# EAGLE schematic LT3579_SEPIC_Test_Bench (EAGLE 9.6.2)

## Sheet 1 of 4
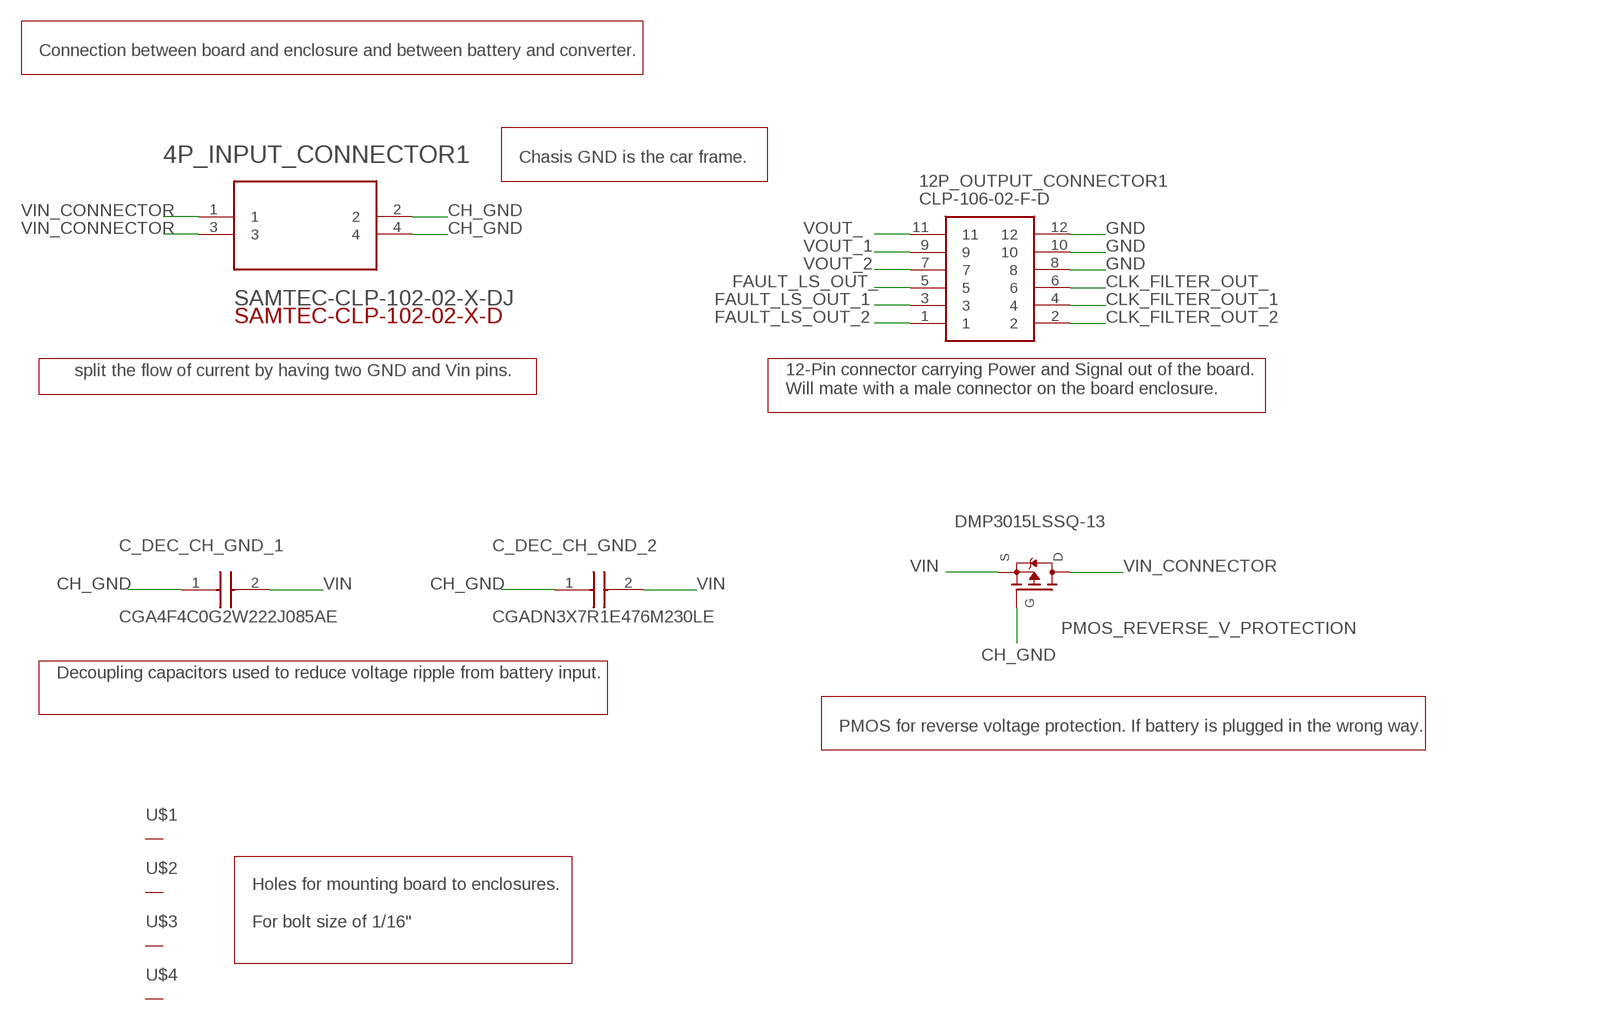
[diagram p0: schematic, sheet 1]

### Parts
4P_INPUT_CONNECTOR1  SAMTEC-CLP-102-02-X-DJ  [SAMTEC-CLP-102-02-X-D]
12P_OUTPUT_CONNECTOR1  CLP-106-02-F-D  [CLP-106-02-XXX]
C_DEC_CH_GND_1  CGA4F4C0G2W222J085AE  [CAPC2012X100N]
C_DEC_CH_GND_2  CGADN3X7R1E476M230LE  [CAPC7563X250N]
PMOS_REVERSE_V_PROTECTION  DMP3015LSSQ-13  [SOIC127P600X170-8N]
U$1  THROUGH_HOLE_  [THROUGH_HOLE]
U$2  THROUGH_HOLE_  [THROUGH_HOLE]
U$3  THROUGH_HOLE_  [THROUGH_HOLE]
U$4  THROUGH_HOLE_  [THROUGH_HOLE]

### Nets
CH_GND [PWR_Vin_Vout]: 4P_INPUT_CONNECTOR1.2 4P_INPUT_CONNECTOR1.4 C_DEC_CH_GND_1.1 C_DEC_CH_GND_2.1 PMOS_REVERSE_V_PROTECTION.4(G1) ; also sheet 2,3,4
CLK_FILTER_OUT_ [Signal]: 12P_OUTPUT_CONNECTOR1.6 ; also sheet 2
CLK_FILTER_OUT_1 [Signal]: 12P_OUTPUT_CONNECTOR1.4 ; also sheet 3
CLK_FILTER_OUT_2 [Signal]: 12P_OUTPUT_CONNECTOR1.2 ; also sheet 4
FAULT_LS_OUT_ [Signal]: 12P_OUTPUT_CONNECTOR1.5 ; also sheet 2
FAULT_LS_OUT_1 [Signal]: 12P_OUTPUT_CONNECTOR1.3 ; also sheet 3
FAULT_LS_OUT_2 [Signal]: 12P_OUTPUT_CONNECTOR1.1 ; also sheet 4
GND: 12P_OUTPUT_CONNECTOR1.8 12P_OUTPUT_CONNECTOR1.10 12P_OUTPUT_CONNECTOR1.12 ; also sheet 2,3,4
VIN [PWR_Vin]: C_DEC_CH_GND_1.2 C_DEC_CH_GND_2.2 PMOS_REVERSE_V_PROTECTION.1(S1) PMOS_REVERSE_V_PROTECTION.2(S1) PMOS_REVERSE_V_PROTECTION.3(S1) ; also sheet 2,3,4
VIN_CONNECTOR [PWR_Connector]: 4P_INPUT_CONNECTOR1.1 4P_INPUT_CONNECTOR1.3 PMOS_REVERSE_V_PROTECTION.5(D1) PMOS_REVERSE_V_PROTECTION.6(D1) PMOS_REVERSE_V_PROTECTION.7(D1) PMOS_REVERSE_V_PROTECTION.8(D1)
VOUT_ [PWR_Vin_Vout]: 12P_OUTPUT_CONNECTOR1.11 ; also sheet 2
VOUT_1 [PWR_Vin_Vout]: 12P_OUTPUT_CONNECTOR1.9 ; also sheet 3
VOUT_2 [PWR_Vin_Vout]: 12P_OUTPUT_CONNECTOR1.7 ; also sheet 4
Unconnected: U$1.THROUGH_HOLE U$2.THROUGH_HOLE U$3.THROUGH_HOLE U$4.THROUGH_HOLE

### Notes on the sheet
- Connection between board and enclosure and between battery and converter.
- Chasis GND is the car frame.
- split the flow of current by having two GND and Vin pins.
- 12-Pin connector carrying Power and Signal out of the board. 
  Will mate with a male connector on the board enclosure.
- Decoupling capacitors used to reduce voltage ripple from battery input.
- PMOS for reverse voltage protection. If battery is plugged in the wrong way.
- Holes for mounting board to enclosures.
  
  For bolt size of 1/16"

## Sheet 2 of 4
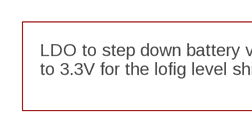
[diagram p1: schematic, sheet 2, part 1 of 2]
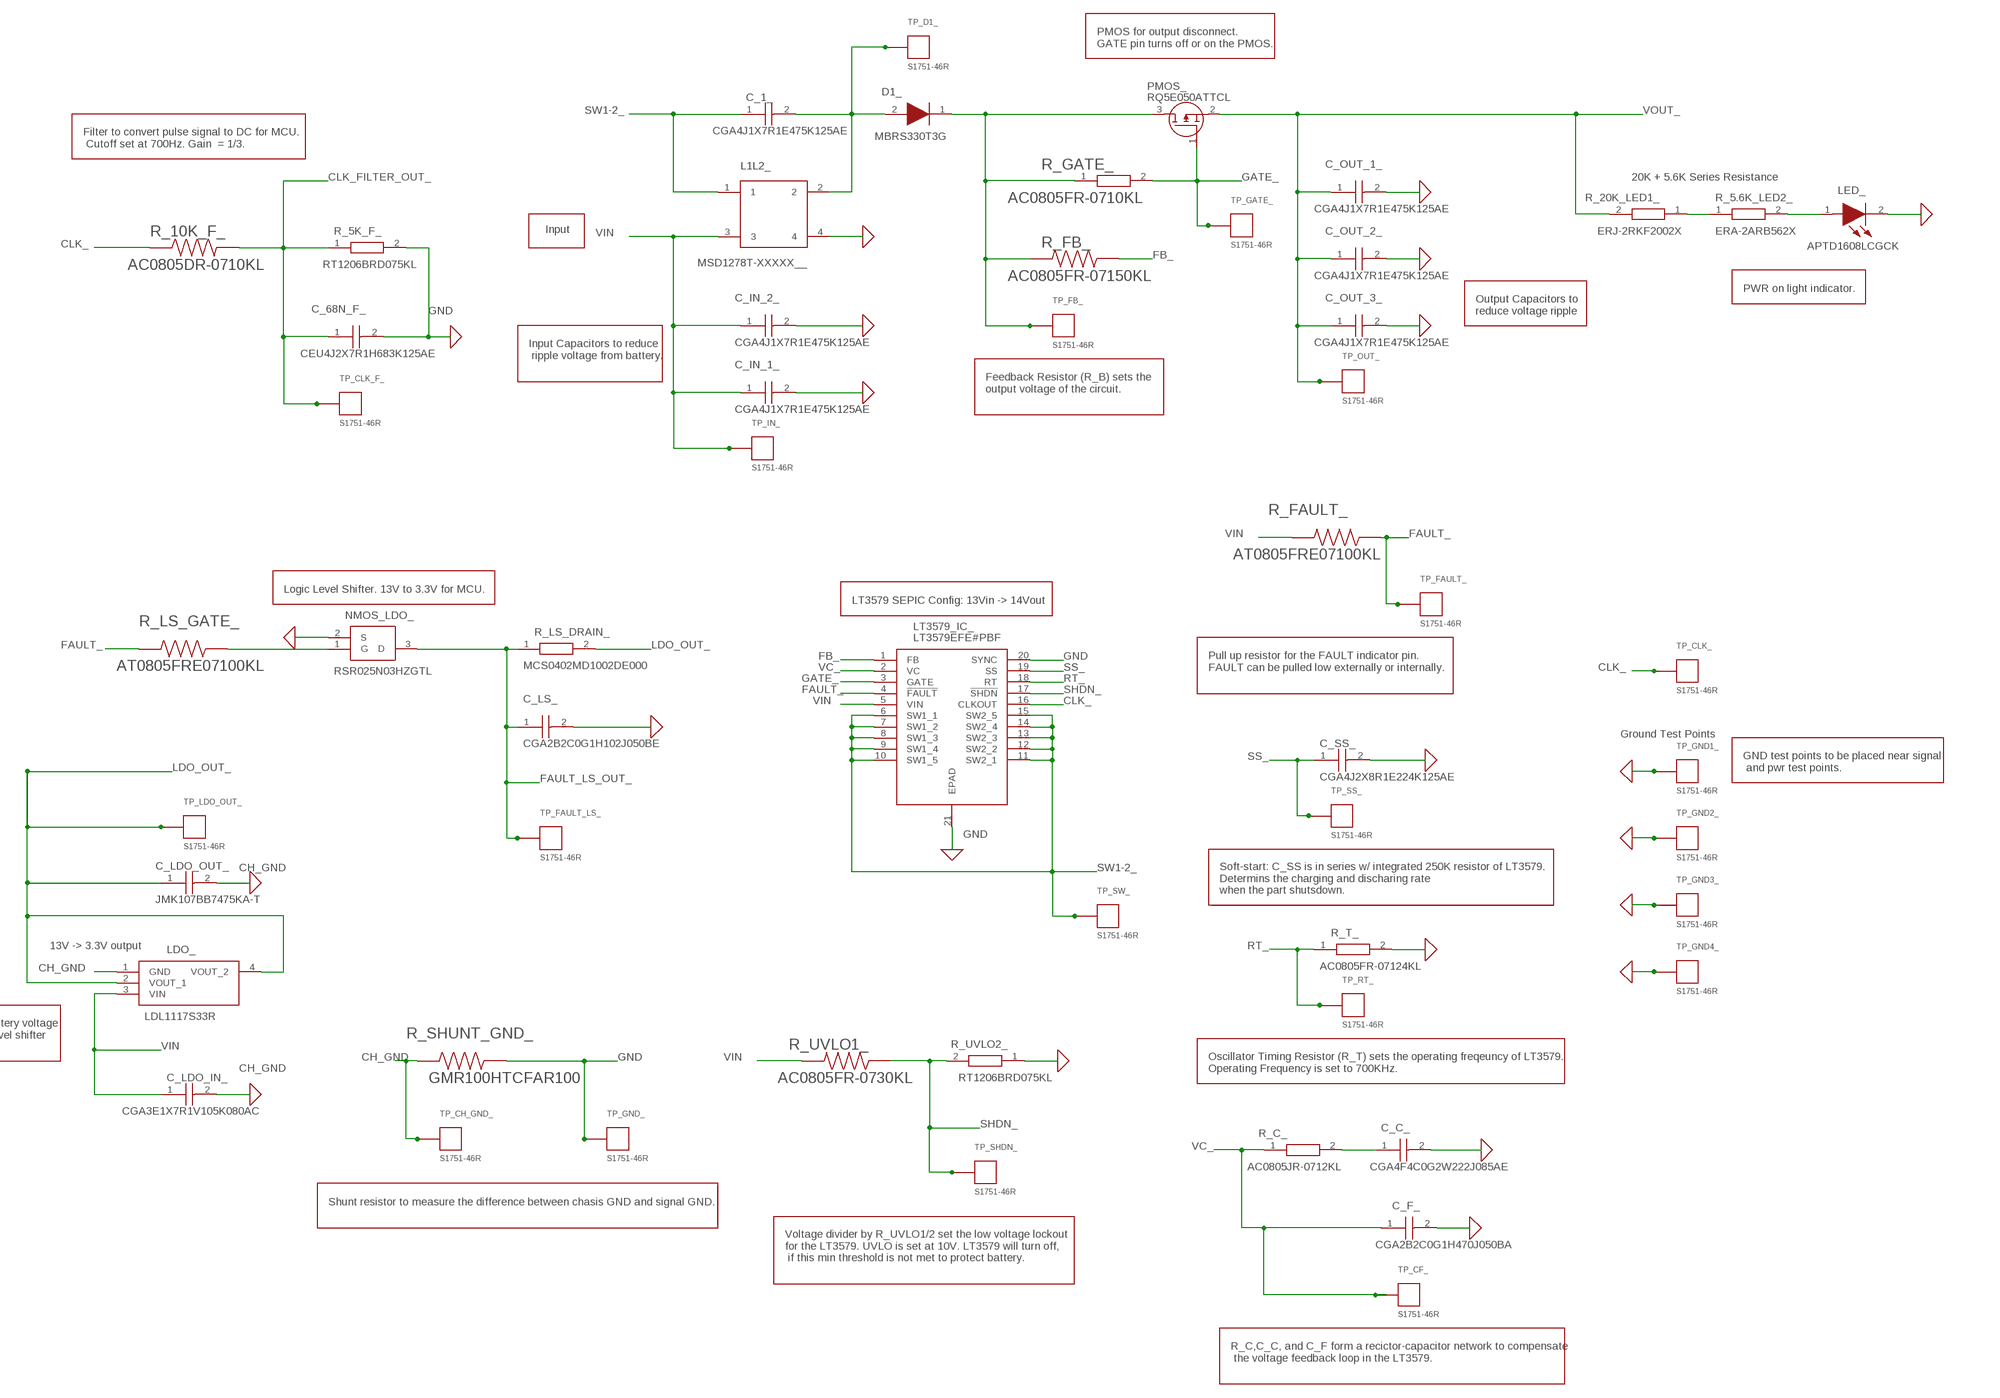
[diagram p2: schematic, sheet 2, part 2 of 2]

### Parts
C_1_  CGA4J1X7R1E475K125AE  [CAPC2012X145N]
C_68N_F_  CEU4J2X7R1H683K125AE  [CAPC2013X150N]
C_C_  CGA4F4C0G2W222J085AE  [CAPC2012X100N]
C_F_  CGA2B2C0G1H470J050BA  [CAPC1005X55N]
C_IN_1_  CGA4J1X7R1E475K125AE  [CAPC2012X145N]
C_IN_2_  CGA4J1X7R1E475K125AE  [CAPC2012X145N]
C_LDO_IN_  CGA3E1X7R1V105K080AC  [CAPC1608X90N]
C_LDO_OUT_  JMK107BB7475KA-T  [CAPC1608X90N]
C_LS_  CGA2B2C0G1H102J050BE  [CAPC1005X55N]
C_OUT_1_  CGA4J1X7R1E475K125AE  [CAPC2012X145N]
C_OUT_2_  CGA4J1X7R1E475K125AE  [CAPC2012X145N]
C_OUT_3_  CGA4J1X7R1E475K125AE  [CAPC2012X145N]
C_SS_  CGA4J2X8R1E224K125AE  [CAPC2012X145N]
D1_  MBRS330T3G  [DIOM7958X256N]
L1L2_  MSD1278T-XXXXX__  [MSD1278T-822MLXX]
LDO_  LDL1117S33R  [SOT230P700X180-4N]
LED_  APTD1608LCGCK  [APT1608CGCK]
LT3579_IC_  LT3579EFE#PBF  [SOP65P640X120-21N]
NMOS_LDO_  RSR025N03HZGTL  [SOT95P280X100-3N]
PMOS_  RQ5E050ATTCL  [SOT95P280X100-3N]
R_5.6K_LED2_  ERA-2ARB562X  [ERA2AED122X]
R_5K_F_  RT1206BRD075KL  [RESC3116X65N]
R_10K_F_  AC0805DR-0710KL  [RESC2012X60N]
R_20K_LED1_  ERJ-2RKF2002X  [ERJ2R_(0402)]
R_C_  AC0805JR-0712KL  [RESC2012X60N]
R_FAULT_  AT0805FRE07100KL  [RESC2012X60N]
R_FB_  AC0805FR-07150KL  [RESC2012X60N]
R_GATE_  AC0805FR-0710KL  [RESC2012X60N]
R_LS_DRAIN_  MCS0402MD1002DE000  [RESC1005X37N]
R_LS_GATE_  AT0805FRE07100KL  [RESC2012X60N]
R_SHUNT_GND_  GMR100HTCFAR100  [RESC6432X55N]
R_T_  AC0805FR-07124KL  [RESC2012X60N]
R_UVLO1_  AC0805FR-0730KL  [RESC2012X60N]
R_UVLO2_  RT1206BRD075KL  [RESC3116X65N]
TP_CF_  S1751-46R  [S1751-46R_]
TP_CH_GND_  S1751-46R  [S1751-46R_]
TP_CLK_  S1751-46R  [S1751-46R_]
TP_CLK_F_  S1751-46R  [S1751-46R_]
TP_D1_  S1751-46R  [S1751-46R_]
TP_FAULT_  S1751-46R  [S1751-46R_]
TP_FAULT_LS_  S1751-46R  [S1751-46R_]
TP_FB_  S1751-46R  [S1751-46R_]
TP_GATE_  S1751-46R  [S1751-46R_]
TP_GND1_  S1751-46R  [S1751-46R_]
TP_GND2_  S1751-46R  [S1751-46R_]
TP_GND3_  S1751-46R  [S1751-46R_]
TP_GND4_  S1751-46R  [S1751-46R_]
TP_GND_  S1751-46R  [S1751-46R_]
TP_IN_  S1751-46R  [S1751-46R_]
TP_LDO_OUT_  S1751-46R  [S1751-46R_]
TP_OUT_  S1751-46R  [S1751-46R_]
TP_RT_  S1751-46R  [S1751-46R_]
TP_SHDN_  S1751-46R  [S1751-46R_]
TP_SS_  S1751-46R  [S1751-46R_]
TP_SW_  S1751-46R  [S1751-46R_]

### Nets
CH_GND [PWR_Vin_Vout]: C_LDO_IN_.2 C_LDO_OUT_.2 LDO_.1(GND) R_SHUNT_GND_.1 TP_CH_GND_.1 ; supply symbol labelled GND ; also sheet 1,3,4
CLK_ [Signal]: LT3579_IC_.16(CLKOUT) R_10K_F_.1 TP_CLK_.1
CLK_FILTER_OUT_ [Signal]: C_68N_F_.1 R_5K_F_.1 R_10K_F_.2 TP_CLK_F_.1 ; also sheet 1
FAULT_ [Signal]: LT3579_IC_.4(!FAULT) R_FAULT_.1 R_LS_GATE_.1 TP_FAULT_.1
FAULT_LS_OUT_ [Signal]: C_LS_.1 NMOS_LDO_.3(D) R_LS_DRAIN_.1 TP_FAULT_LS_.1 ; also sheet 1
FB_ [Signal]: LT3579_IC_.1(FB) R_FB_.2
GATE_ [Signal]: LT3579_IC_.3(GATE) PMOS_.1(G) R_GATE_.2 TP_GATE_.1
GND: C_68N_F_.2 C_C_.2 C_F_.2 C_IN_1_.2 C_IN_2_.2 C_LS_.2 C_OUT_1_.2 C_OUT_2_.2 C_OUT_3_.2 C_SS_.2 L1L2_.4 LED_.2(K) LT3579_IC_.20(SYNC) LT3579_IC_.21(EPAD) NMOS_LDO_.2(S) R_5K_F_.2 R_SHUNT_GND_.2 R_T_.2 R_UVLO2_.1 TP_GND1_.1 TP_GND2_.1 TP_GND3_.1 TP_GND4_.1 TP_GND_.1 ; also sheet 1,3,4
LDO_OUT_ [PWR_Vin_Vout]: C_LDO_OUT_.1 LDO_.2(VOUT_1) LDO_.4(VOUT_2) R_LS_DRAIN_.2 TP_LDO_OUT_.1 ; also sheet 3,4
N$4 [Signal]: C_C_.1 R_C_.2
N$8 [Signal]: NMOS_LDO_.1(G) R_LS_GATE_.2
N$9 [PWR_Vin_Vout]: C_1_.2 D1_.2(A) L1L2_.2 TP_D1_.1
N$12 [Signal]: R_5.6K_LED2_.1 R_20K_LED1_.1
N$13 [PWR_Vin_Vout]: D1_.1(K) PMOS_.3(D) R_FB_.1 R_GATE_.1 TP_FB_.1
N$15 [Signal]: LED_.1(A) R_5.6K_LED2_.2
RT_ [Signal]: LT3579_IC_.18(RT) R_T_.1 TP_RT_.1
SHDN_ [Signal]: LT3579_IC_.17(!SHDN) R_UVLO1_.1 R_UVLO2_.2 TP_SHDN_.1
SS_ [Signal]: C_SS_.1 LT3579_IC_.19(SS) TP_SS_.1
SW1-2_ [PWR_Vin_Vout]: C_1_.1 L1L2_.1 LT3579_IC_.6(SW1_1) LT3579_IC_.7(SW1_2) LT3579_IC_.8(SW1_3) LT3579_IC_.9(SW1_4) LT3579_IC_.10(SW1_5) LT3579_IC_.11(SW2_1) LT3579_IC_.12(SW2_2) LT3579_IC_.13(SW2_3) LT3579_IC_.14(SW2_4) LT3579_IC_.15(SW2_5) TP_SW_.1
VC_ [Signal]: C_F_.1 LT3579_IC_.2(VC) R_C_.1 TP_CF_.1
VIN [PWR_Vin]: C_IN_1_.1 C_IN_2_.1 C_LDO_IN_.1 L1L2_.3 LDO_.3(VIN) LT3579_IC_.5(VIN) R_FAULT_.2 R_UVLO1_.2 TP_IN_.1 ; also sheet 1,3,4
VOUT_ [PWR_Vin_Vout]: C_OUT_1_.1 C_OUT_2_.1 C_OUT_3_.1 PMOS_.2(S) R_20K_LED1_.2 TP_OUT_.1 ; also sheet 1

### Notes on the sheet
- PMOS for output disconnect. 
  GATE pin turns off or on the PMOS.
- Filter to convert pulse signal to DC for MCU.
   Cutoff set at 700Hz. Gain  = 1/3.
- 20K + 5.6K Series Resistance
- Input
- PWR on light indicator.
- Output Capacitors to 
  reduce voltage ripple
- Input Capacitors to reduce
   ripple voltage from battery.
- Feedback Resistor (R_B) sets the
  output voltage of the circuit.
- Logic Level Shifter. 13V to 3.3V for MCU.
- LT3579 SEPIC Config: 13Vin -> 14Vout
- Pull up resistor for the FAULT indicator pin. 
  FAULT can be pulled low externally or internally.
- Ground Test Points
- GND test points to be placed near signal
   and pwr test points.
- Soft-start: C_SS is in series w/ integrated 250K resistor of LT3579. 
  Determins the charging and discharing rate 
  when the part shutsdown.
- 13V -> 3.3V output
- LDO to step down battery voltage
  to 3.3V for the lofig level shifter
- Oscillator Timing Resistor (R_T) sets the operating freqeuncy of LT3579. 
  Operating Frequency is set to 700KHz.
- Shunt resistor to measure the difference between chasis GND and signal GND.
- Voltage divider by R_UVLO1/2 set the low voltage lockout 
  for the LT3579. UVLO is set at 10V. LT3579 will turn off,
   if this min threshold is not met to protect battery.
- R_C,C_C, and C_F form a recictor-capacitor network to compensate
   the voltage feedback loop in the LT3579.

## Sheet 3 of 4
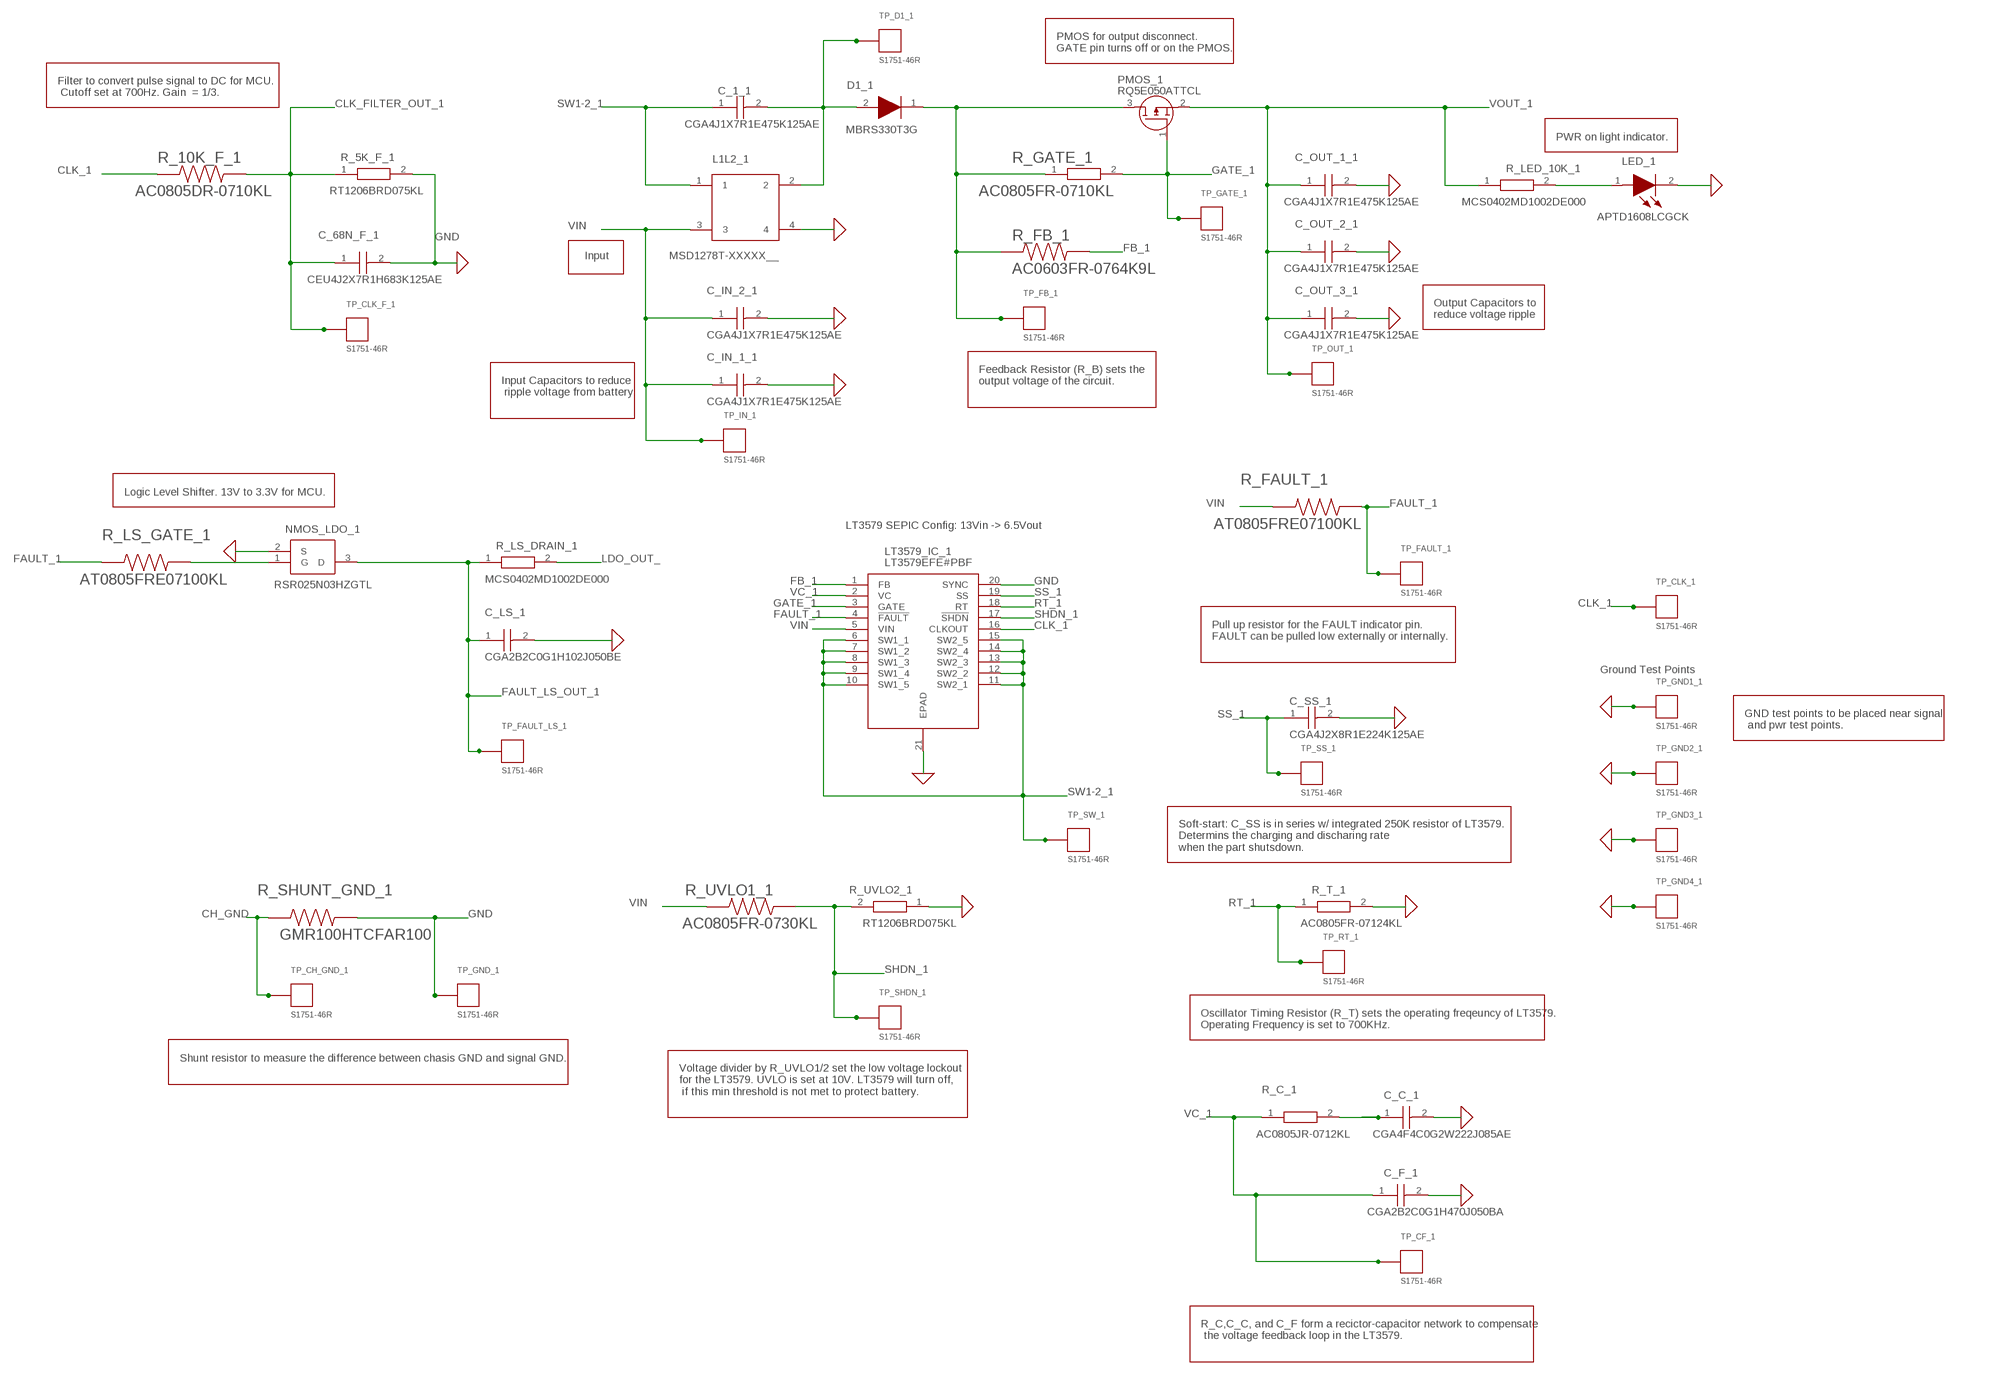
[diagram p3: schematic, sheet 3]

### Parts
C_1_1  CGA4J1X7R1E475K125AE  [CAPC2012X145N]
C_68N_F_1  CEU4J2X7R1H683K125AE  [CAPC2013X150N]
C_C_1  CGA4F4C0G2W222J085AE  [CAPC2012X100N]
C_F_1  CGA2B2C0G1H470J050BA  [CAPC1005X55N]
C_IN_1_1  CGA4J1X7R1E475K125AE  [CAPC2012X145N]
C_IN_2_1  CGA4J1X7R1E475K125AE  [CAPC2012X145N]
C_LS_1  CGA2B2C0G1H102J050BE  [CAPC1005X55N]
C_OUT_1_1  CGA4J1X7R1E475K125AE  [CAPC2012X145N]
C_OUT_2_1  CGA4J1X7R1E475K125AE  [CAPC2012X145N]
C_OUT_3_1  CGA4J1X7R1E475K125AE  [CAPC2012X145N]
C_SS_1  CGA4J2X8R1E224K125AE  [CAPC2012X145N]
D1_1  MBRS330T3G  [DIOM7958X256N]
L1L2_1  MSD1278T-XXXXX__  [MSD1278T-822MLXX]
LED_1  APTD1608LCGCK  [APT1608CGCK]
LT3579_IC_1  LT3579EFE#PBF  [SOP65P640X120-21N]
NMOS_LDO_1  RSR025N03HZGTL  [SOT95P280X100-3N]
PMOS_1  RQ5E050ATTCL  [SOT95P280X100-3N]
R_5K_F_1  RT1206BRD075KL  [RESC3116X65N]
R_10K_F_1  AC0805DR-0710KL  [RESC2012X60N]
R_C_1  AC0805JR-0712KL  [RESC2012X60N]
R_FAULT_1  AT0805FRE07100KL  [RESC2012X60N]
R_FB_1  AC0603FR-0764K9L  [RESC1608X55N]
R_GATE_1  AC0805FR-0710KL  [RESC2012X60N]
R_LED_10K_1  MCS0402MD1002DE000  [RESC1005X37N]
R_LS_DRAIN_1  MCS0402MD1002DE000  [RESC1005X37N]
R_LS_GATE_1  AT0805FRE07100KL  [RESC2012X60N]
R_SHUNT_GND_1  GMR100HTCFAR100  [RESC6432X55N]
R_T_1  AC0805FR-07124KL  [RESC2012X60N]
R_UVLO1_1  AC0805FR-0730KL  [RESC2012X60N]
R_UVLO2_1  RT1206BRD075KL  [RESC3116X65N]
TP_CF_1  S1751-46R  [S1751-46R_]
TP_CH_GND_1  S1751-46R  [S1751-46R_]
TP_CLK_1  S1751-46R  [S1751-46R_]
TP_CLK_F_1  S1751-46R  [S1751-46R_]
TP_D1_1  S1751-46R  [S1751-46R_]
TP_FAULT_1  S1751-46R  [S1751-46R_]
TP_FAULT_LS_1  S1751-46R  [S1751-46R_]
TP_FB_1  S1751-46R  [S1751-46R_]
TP_GATE_1  S1751-46R  [S1751-46R_]
TP_GND1_1  S1751-46R  [S1751-46R_]
TP_GND2_1  S1751-46R  [S1751-46R_]
TP_GND3_1  S1751-46R  [S1751-46R_]
TP_GND4_1  S1751-46R  [S1751-46R_]
TP_GND_1  S1751-46R  [S1751-46R_]
TP_IN_1  S1751-46R  [S1751-46R_]
TP_OUT_1  S1751-46R  [S1751-46R_]
TP_RT_1  S1751-46R  [S1751-46R_]
TP_SHDN_1  S1751-46R  [S1751-46R_]
TP_SS_1  S1751-46R  [S1751-46R_]
TP_SW_1  S1751-46R  [S1751-46R_]

### Nets
CH_GND [PWR_Vin_Vout]: R_SHUNT_GND_1.1 TP_CH_GND_1.1 ; also sheet 1,2,4
CLK_1 [Signal]: LT3579_IC_1.16(CLKOUT) R_10K_F_1.1 TP_CLK_1.1
CLK_FILTER_OUT_1 [Signal]: C_68N_F_1.1 R_5K_F_1.1 R_10K_F_1.2 TP_CLK_F_1.1 ; also sheet 1
FAULT_1 [Signal]: LT3579_IC_1.4(!FAULT) R_FAULT_1.1 R_LS_GATE_1.1 TP_FAULT_1.1
FAULT_LS_OUT_1 [Signal]: C_LS_1.1 NMOS_LDO_1.3(D) R_LS_DRAIN_1.1 TP_FAULT_LS_1.1 ; also sheet 1
FB_1 [Signal]: LT3579_IC_1.1(FB) R_FB_1.2
GATE_1 [Signal]: LT3579_IC_1.3(GATE) PMOS_1.1(G) R_GATE_1.2 TP_GATE_1.1
GND: C_68N_F_1.2 C_C_1.2 C_F_1.2 C_IN_1_1.2 C_IN_2_1.2 C_LS_1.2 C_OUT_1_1.2 C_OUT_2_1.2 C_OUT_3_1.2 C_SS_1.2 L1L2_1.4 LED_1.2(K) LT3579_IC_1.20(SYNC) LT3579_IC_1.21(EPAD) NMOS_LDO_1.2(S) R_5K_F_1.2 R_SHUNT_GND_1.2 R_T_1.2 R_UVLO2_1.1 TP_GND1_1.1 TP_GND2_1.1 TP_GND3_1.1 TP_GND4_1.1 TP_GND_1.1 ; also sheet 1,2,4
LDO_OUT_ [PWR_Vin_Vout]: R_LS_DRAIN_1.2 ; also sheet 2,4
N$1 [PWR_Vin_Vout]: C_1_1.2 D1_1.2(A) L1L2_1.2 TP_D1_1.1
N$2 [Signal]: C_C_1.1 R_C_1.2
N$3 [PWR_Vin_Vout]: D1_1.1(K) PMOS_1.3(D) R_FB_1.1 R_GATE_1.1 TP_FB_1.1
N$10 [Signal]: NMOS_LDO_1.1(G) R_LS_GATE_1.2
N$11 [PWR_Vin_Vout]: LED_1.1(A) R_LED_10K_1.2
RT_1 [Signal]: LT3579_IC_1.18(RT) R_T_1.1 TP_RT_1.1
SHDN_1 [Signal]: LT3579_IC_1.17(!SHDN) R_UVLO1_1.1 R_UVLO2_1.2 TP_SHDN_1.1
SS_1 [Signal]: C_SS_1.1 LT3579_IC_1.19(SS) TP_SS_1.1
SW1-2_1 [PWR_Vin_Vout]: C_1_1.1 L1L2_1.1 LT3579_IC_1.6(SW1_1) LT3579_IC_1.7(SW1_2) LT3579_IC_1.8(SW1_3) LT3579_IC_1.9(SW1_4) LT3579_IC_1.10(SW1_5) LT3579_IC_1.11(SW2_1) LT3579_IC_1.12(SW2_2) LT3579_IC_1.13(SW2_3) LT3579_IC_1.14(SW2_4) LT3579_IC_1.15(SW2_5) TP_SW_1.1
VC_1 [Signal]: C_F_1.1 LT3579_IC_1.2(VC) R_C_1.1 TP_CF_1.1
VIN [PWR_Vin]: C_IN_1_1.1 C_IN_2_1.1 L1L2_1.3 LT3579_IC_1.5(VIN) R_FAULT_1.2 R_UVLO1_1.2 TP_IN_1.1 ; also sheet 1,2,4
VOUT_1 [PWR_Vin_Vout]: C_OUT_1_1.1 C_OUT_2_1.1 C_OUT_3_1.1 PMOS_1.2(S) R_LED_10K_1.1 TP_OUT_1.1 ; also sheet 1

### Notes on the sheet
- PMOS for output disconnect. 
  GATE pin turns off or on the PMOS.
- Filter to convert pulse signal to DC for MCU.
   Cutoff set at 700Hz. Gain  = 1/3.
- PWR on light indicator.
- Input
- Output Capacitors to 
  reduce voltage ripple
- Feedback Resistor (R_B) sets the
  output voltage of the circuit.
- Input Capacitors to reduce
   ripple voltage from battery.
- Logic Level Shifter. 13V to 3.3V for MCU.
- LT3579 SEPIC Config: 13Vin -> 6.5Vout
- Pull up resistor for the FAULT indicator pin. 
  FAULT can be pulled low externally or internally.
- Ground Test Points
- GND test points to be placed near signal
   and pwr test points.
- Soft-start: C_SS is in series w/ integrated 250K resistor of LT3579. 
  Determins the charging and discharing rate 
  when the part shutsdown.
- Oscillator Timing Resistor (R_T) sets the operating freqeuncy of LT3579. 
  Operating Frequency is set to 700KHz.
- Shunt resistor to measure the difference between chasis GND and signal GND.
- Voltage divider by R_UVLO1/2 set the low voltage lockout 
  for the LT3579. UVLO is set at 10V. LT3579 will turn off,
   if this min threshold is not met to protect battery.
- R_C,C_C, and C_F form a recictor-capacitor network to compensate
   the voltage feedback loop in the LT3579.

## Sheet 4 of 4
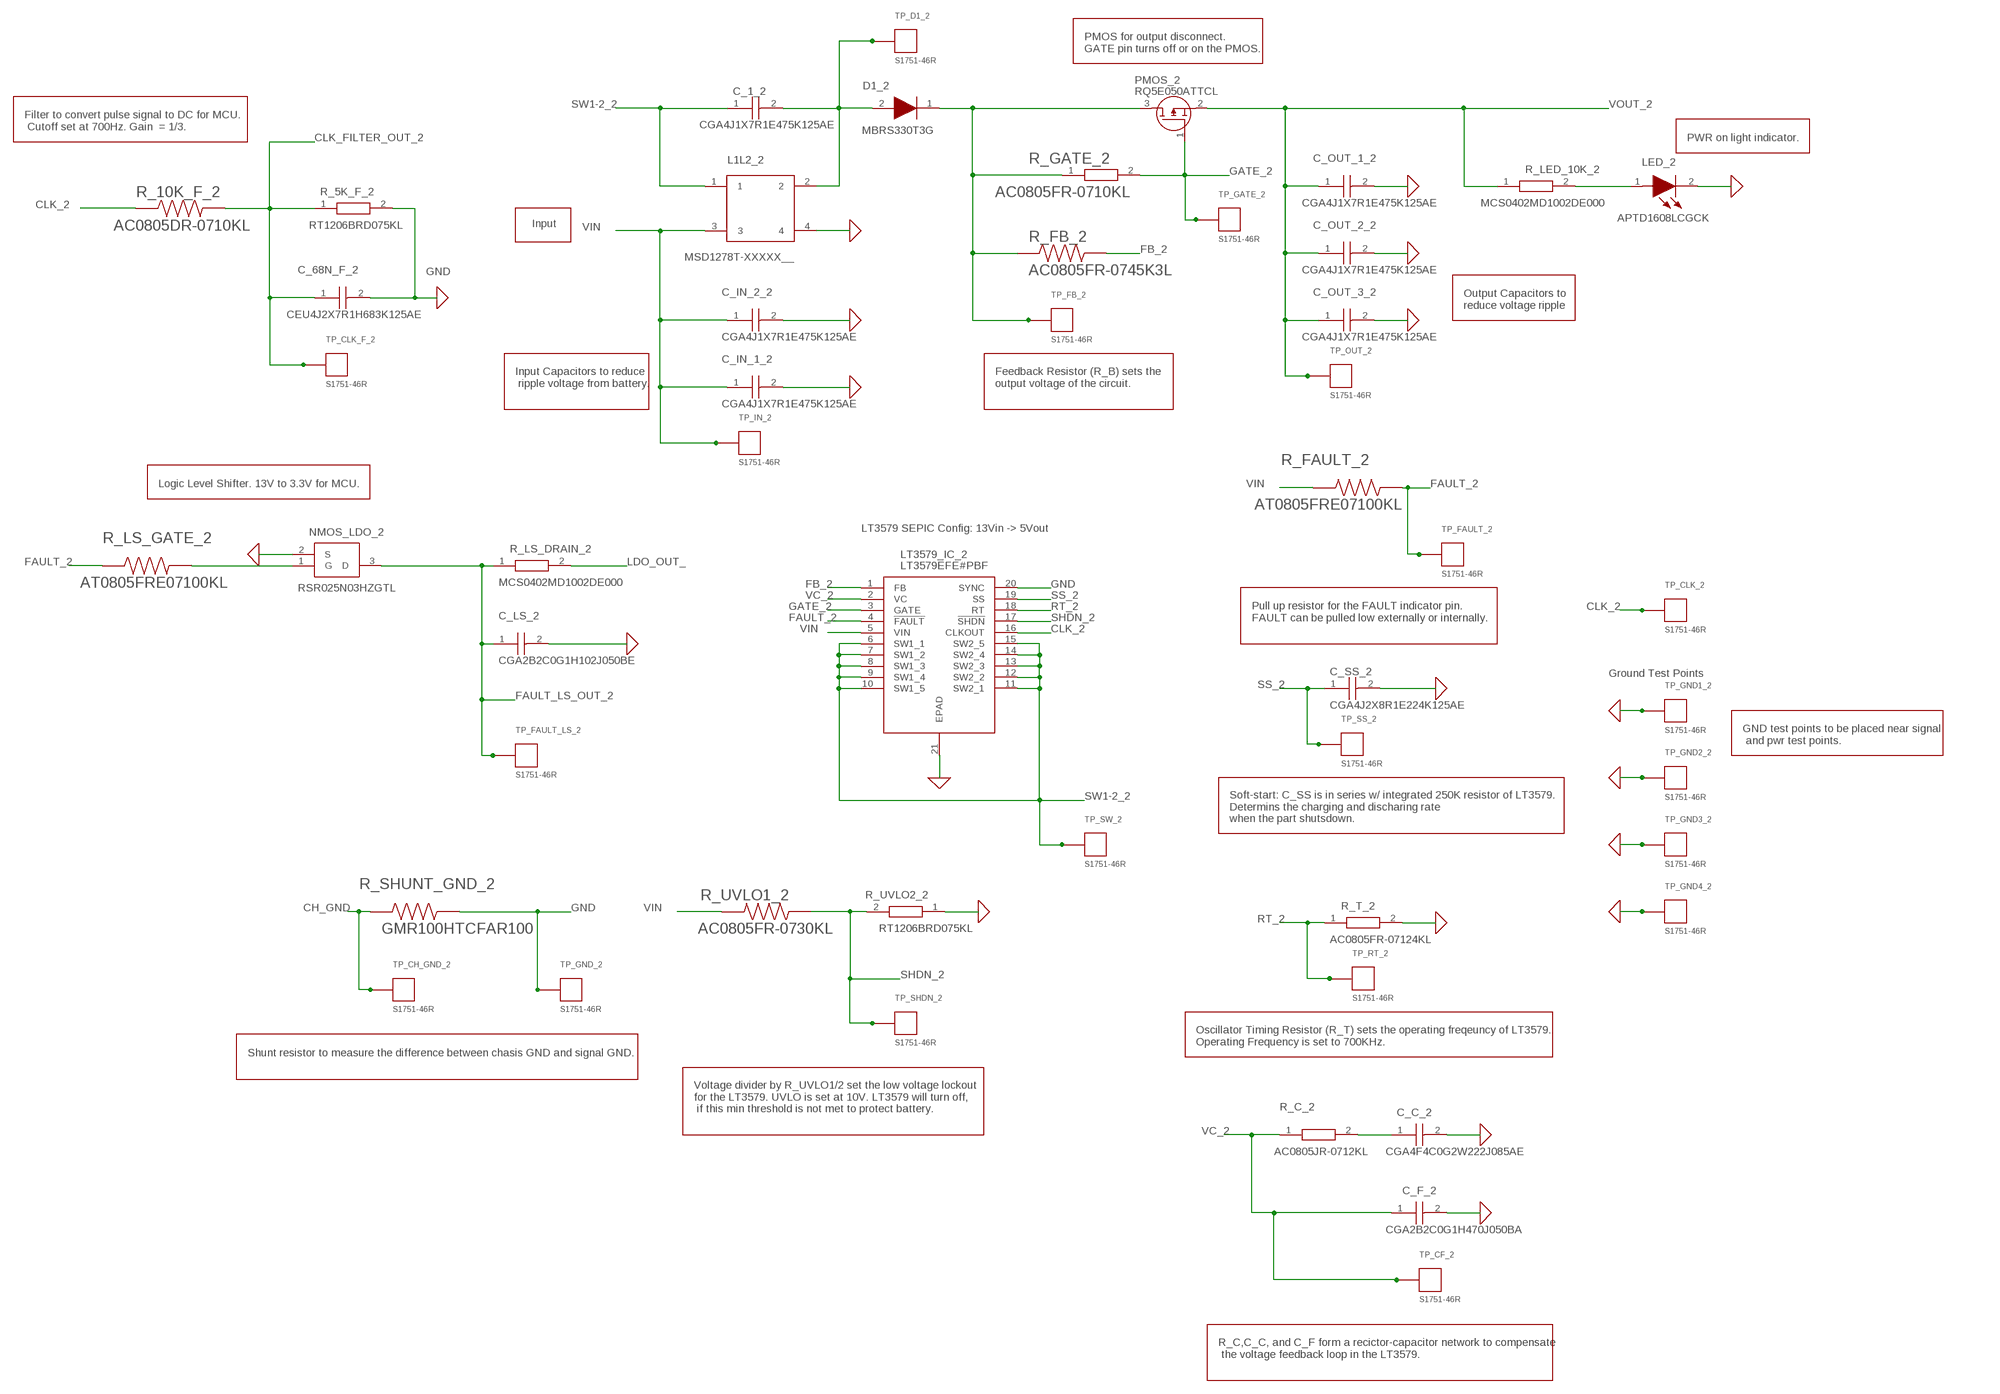
[diagram p4: schematic, sheet 4]

### Parts
C_1_2  CGA4J1X7R1E475K125AE  [CAPC2012X145N]
C_68N_F_2  CEU4J2X7R1H683K125AE  [CAPC2013X150N]
C_C_2  CGA4F4C0G2W222J085AE  [CAPC2012X100N]
C_F_2  CGA2B2C0G1H470J050BA  [CAPC1005X55N]
C_IN_1_2  CGA4J1X7R1E475K125AE  [CAPC2012X145N]
C_IN_2_2  CGA4J1X7R1E475K125AE  [CAPC2012X145N]
C_LS_2  CGA2B2C0G1H102J050BE  [CAPC1005X55N]
C_OUT_1_2  CGA4J1X7R1E475K125AE  [CAPC2012X145N]
C_OUT_2_2  CGA4J1X7R1E475K125AE  [CAPC2012X145N]
C_OUT_3_2  CGA4J1X7R1E475K125AE  [CAPC2012X145N]
C_SS_2  CGA4J2X8R1E224K125AE  [CAPC2012X145N]
D1_2  MBRS330T3G  [DIOM7958X256N]
L1L2_2  MSD1278T-XXXXX__  [MSD1278T-822MLXX]
LED_2  APTD1608LCGCK  [APT1608CGCK]
LT3579_IC_2  LT3579EFE#PBF  [SOP65P640X120-21N]
NMOS_LDO_2  RSR025N03HZGTL  [SOT95P280X100-3N]
PMOS_2  RQ5E050ATTCL  [SOT95P280X100-3N]
R_5K_F_2  RT1206BRD075KL  [RESC3116X65N]
R_10K_F_2  AC0805DR-0710KL  [RESC2012X60N]
R_C_2  AC0805JR-0712KL  [RESC2012X60N]
R_FAULT_2  AT0805FRE07100KL  [RESC2012X60N]
R_FB_2  AC0805FR-0745K3L  [RESC2012X60N]
R_GATE_2  AC0805FR-0710KL  [RESC2012X60N]
R_LED_10K_2  MCS0402MD1002DE000  [RESC1005X37N]
R_LS_DRAIN_2  MCS0402MD1002DE000  [RESC1005X37N]
R_LS_GATE_2  AT0805FRE07100KL  [RESC2012X60N]
R_SHUNT_GND_2  GMR100HTCFAR100  [RESC6432X55N]
R_T_2  AC0805FR-07124KL  [RESC2012X60N]
R_UVLO1_2  AC0805FR-0730KL  [RESC2012X60N]
R_UVLO2_2  RT1206BRD075KL  [RESC3116X65N]
TP_CF_2  S1751-46R  [S1751-46R_]
TP_CH_GND_2  S1751-46R  [S1751-46R_]
TP_CLK_2  S1751-46R  [S1751-46R_]
TP_CLK_F_2  S1751-46R  [S1751-46R_]
TP_D1_2  S1751-46R  [S1751-46R_]
TP_FAULT_2  S1751-46R  [S1751-46R_]
TP_FAULT_LS_2  S1751-46R  [S1751-46R_]
TP_FB_2  S1751-46R  [S1751-46R_]
TP_GATE_2  S1751-46R  [S1751-46R_]
TP_GND1_2  S1751-46R  [S1751-46R_]
TP_GND2_2  S1751-46R  [S1751-46R_]
TP_GND3_2  S1751-46R  [S1751-46R_]
TP_GND4_2  S1751-46R  [S1751-46R_]
TP_GND_2  S1751-46R  [S1751-46R_]
TP_IN_2  S1751-46R  [S1751-46R_]
TP_OUT_2  S1751-46R  [S1751-46R_]
TP_RT_2  S1751-46R  [S1751-46R_]
TP_SHDN_2  S1751-46R  [S1751-46R_]
TP_SS_2  S1751-46R  [S1751-46R_]
TP_SW_2  S1751-46R  [S1751-46R_]

### Nets
CH_GND [PWR_Vin_Vout]: R_SHUNT_GND_2.1 TP_CH_GND_2.1 ; also sheet 1,2,3
CLK_2 [Signal]: LT3579_IC_2.16(CLKOUT) R_10K_F_2.1 TP_CLK_2.1
CLK_FILTER_OUT_2 [Signal]: C_68N_F_2.1 R_5K_F_2.1 R_10K_F_2.2 TP_CLK_F_2.1 ; also sheet 1
FAULT_2 [Signal]: LT3579_IC_2.4(!FAULT) R_FAULT_2.1 R_LS_GATE_2.1 TP_FAULT_2.1
FAULT_LS_OUT_2 [Signal]: C_LS_2.1 NMOS_LDO_2.3(D) R_LS_DRAIN_2.1 TP_FAULT_LS_2.1 ; also sheet 1
FB_2 [Signal]: LT3579_IC_2.1(FB) R_FB_2.2
GATE_2 [Signal]: LT3579_IC_2.3(GATE) PMOS_2.1(G) R_GATE_2.2 TP_GATE_2.1
GND: C_68N_F_2.2 C_C_2.2 C_F_2.2 C_IN_1_2.2 C_IN_2_2.2 C_LS_2.2 C_OUT_1_2.2 C_OUT_2_2.2 C_OUT_3_2.2 C_SS_2.2 L1L2_2.4 LED_2.2(K) LT3579_IC_2.20(SYNC) LT3579_IC_2.21(EPAD) NMOS_LDO_2.2(S) R_5K_F_2.2 R_SHUNT_GND_2.2 R_T_2.2 R_UVLO2_2.1 TP_GND1_2.1 TP_GND2_2.1 TP_GND3_2.1 TP_GND4_2.1 TP_GND_2.1 ; also sheet 1,2,3
LDO_OUT_ [PWR_Vin_Vout]: R_LS_DRAIN_2.2 ; also sheet 2,3
N$5 [PWR_Vin_Vout]: C_1_2.2 D1_2.2(A) L1L2_2.2 TP_D1_2.1
N$6 [Signal]: C_C_2.1 R_C_2.2
N$7 [PWR_Vin_Vout]: D1_2.1(K) PMOS_2.3(D) R_FB_2.1 R_GATE_2.1 TP_FB_2.1
N$14 [Signal]: NMOS_LDO_2.1(G) R_LS_GATE_2.2
N$16 [PWR_Vin_Vout]: LED_2.1(A) R_LED_10K_2.2
RT_2 [Signal]: LT3579_IC_2.18(RT) R_T_2.1 TP_RT_2.1
SHDN_2 [Signal]: LT3579_IC_2.17(!SHDN) R_UVLO1_2.1 R_UVLO2_2.2 TP_SHDN_2.1
SS_2 [Signal]: C_SS_2.1 LT3579_IC_2.19(SS) TP_SS_2.1
SW1-2_2 [PWR_Vin_Vout]: C_1_2.1 L1L2_2.1 LT3579_IC_2.6(SW1_1) LT3579_IC_2.7(SW1_2) LT3579_IC_2.8(SW1_3) LT3579_IC_2.9(SW1_4) LT3579_IC_2.10(SW1_5) LT3579_IC_2.11(SW2_1) LT3579_IC_2.12(SW2_2) LT3579_IC_2.13(SW2_3) LT3579_IC_2.14(SW2_4) LT3579_IC_2.15(SW2_5) TP_SW_2.1
VC_2 [Signal]: C_F_2.1 LT3579_IC_2.2(VC) R_C_2.1 TP_CF_2.1
VIN [PWR_Vin]: C_IN_1_2.1 C_IN_2_2.1 L1L2_2.3 LT3579_IC_2.5(VIN) R_FAULT_2.2 R_UVLO1_2.2 TP_IN_2.1 ; also sheet 1,2,3
VOUT_2 [PWR_Vin_Vout]: C_OUT_1_2.1 C_OUT_2_2.1 C_OUT_3_2.1 PMOS_2.2(S) R_LED_10K_2.1 TP_OUT_2.1 ; also sheet 1

### Notes on the sheet
- PMOS for output disconnect. 
  GATE pin turns off or on the PMOS.
- Filter to convert pulse signal to DC for MCU.
   Cutoff set at 700Hz. Gain  = 1/3.
- PWR on light indicator.
- Input
- Output Capacitors to 
  reduce voltage ripple
- Input Capacitors to reduce
   ripple voltage from battery.
- Feedback Resistor (R_B) sets the
  output voltage of the circuit.
- Logic Level Shifter. 13V to 3.3V for MCU.
- LT3579 SEPIC Config: 13Vin -> 5Vout
- Pull up resistor for the FAULT indicator pin. 
  FAULT can be pulled low externally or internally.
- Ground Test Points
- GND test points to be placed near signal
   and pwr test points.
- Soft-start: C_SS is in series w/ integrated 250K resistor of LT3579. 
  Determins the charging and discharing rate 
  when the part shutsdown.
- Oscillator Timing Resistor (R_T) sets the operating freqeuncy of LT3579. 
  Operating Frequency is set to 700KHz.
- Shunt resistor to measure the difference between chasis GND and signal GND.
- Voltage divider by R_UVLO1/2 set the low voltage lockout 
  for the LT3579. UVLO is set at 10V. LT3579 will turn off,
   if this min threshold is not met to protect battery.
- R_C,C_C, and C_F form a recictor-capacitor network to compensate
   the voltage feedback loop in the LT3579.

## Library data of the parts
4P_INPUT_CONNECTOR1 = LT3579_SEPIC_Test_Bench:SAMTEC-CLP-102-02-X-D; AVAILABILITY: Unavailable; DESCRIPTION: CLP Series .050 Tiger Claw™ Rugged Reliable Dual Wipe Socket Strip; MF: Samtec; MP: CLP-102-02-L-D; PACKAGE: None; PRICE: None
12P_OUTPUT_CONNECTOR1 = LT3579_SEPIC_Test_Bench:CLP-106-02-F-D: 12 Position Connector Header, Center Strip Contacts Surface Mount Source: Datasheet <http://suddendocs.samtec.com/prints/erm8-xxx-xx.x-xxx-dv-xxxx-xx-mkt.pdf>; DESCRIPTION: 12 Position Connector Header, Center Strip Contacts Surface Mount; HEIGHT: mm; MANUFACTURER_NAME: SAMTEC; MANUFACTURER_PART_NUMBER: CLP-106-02-F-D; MOUSER_PART_NUMBER: 200-CLP10602FD; MOUSER_PRICE-STOCK: https://www.mouser.co.uk/ProductDetail/Samtec/CLP-106-02-F-D?qs=0lQeLiL1qybAMPDXLs%252BD8A%3D%3D
C_1_ C_1_1 C_1_2 C_IN_1_ C_IN_1_1 C_IN_1_2 C_IN_2_ C_IN_2_1 C_IN_2_2 C_OUT_1_ C_OUT_1_1 C_OUT_1_2 C_OUT_2_ C_OUT_2_1 C_OUT_2_2 C_OUT_3_ C_OUT_3_1 C_OUT_3_2 = LT3579_SEPIC_Test_Bench:CGA4J1X7R1E475K125AE: Multilayer Ceramic Capacitors MLCC - SMD/SMT 0805 4.7uF 25volts X7R 10% Soft Term Source: Datasheet <https://product.tdk.com/system/files/dam/doc/product/capacitor/ceramic/mlcc/catalog/mlcc_automotive_soft_en.pdf>; DESCRIPTION: Multilayer Ceramic Capacitors MLCC - SMD/SMT 0805 4.7uF 25volts X7R 10% Soft Term; HEIGHT: 1.45mm; MANUFACTURER_NAME: TDK; MANUFACTURER_PART_NUMBER: CGA4J1X7R1E475K125AE; MOUSER_PART_NUMBER: 810-CGA4J1X7R1E475KA; MOUSER_PRICE-STOCK: https://www.mouser.co.uk/ProductDetail/TDK/CGA4J1X7R1E475K125AE/?qs=nQSIdc08i%252BfhTtI2X7XptA%3D%3D
C_68N_F_ C_68N_F_1 C_68N_F_2 = LT3579_SEPIC_Test_Bench:CEU4J2X7R1H683K125AE: Multilayer Ceramic Chip Capacitors, Capacitance=68nF, LxWxT:2x1.25x1.25mm Source: Datasheet <https://product.tdk.com/system/files/dam/doc/product/capacitor/ceramic/mlcc/catalog/mlcc_automotive_serial_en.pdf>; DESCRIPTION: Multilayer Ceramic Chip Capacitors, Capacitance=68nF, LxWxT:2x1.25x1.25mm; HEIGHT: 1.5mm; MANUFACTURER_NAME: TDK; MANUFACTURER_PART_NUMBER: CEU4J2X7R1H683K125AE
C_C_ C_C_1 C_C_2 C_DEC_CH_GND_1 = LT3579_SEPIC_Test_Bench:CGA4F4C0G2W222J085AE: Multilayer Ceramic Capacitors MLCC - SMD/SMT 0805 450V 2.2nF 5% SOFT C0G AEC-Q200 Source: Datasheet <https://product.tdk.com/system/files/dam/doc/product/capacitor/ceramic/mlcc/catalog/mlcc_automotive_soft_en.pdf>; DESCRIPTION: Multilayer Ceramic Capacitors MLCC - SMD/SMT 0805 450V 2.2nF 5% SOFT C0G AEC-Q200; HEIGHT: 1mm; MANUFACTURER_NAME: TDK; MANUFACTURER_PART_NUMBER: CGA4F4C0G2W222J085AE; MOUSER_PART_NUMBER: 810-CGA4F4C0G2W222J0; MOUSER_PRICE-STOCK: https://www.mouser.co.uk/ProductDetail/TDK/CGA4F4C0G2W222J085AE?qs=r5DSvlrkXmLC8kBBrA0jlw%3D%3D
C_DEC_CH_GND_2 = LT3579_SEPIC_Test_Bench:CGADN3X7R1E476M230LE: Multilayer Ceramic Capacitors MLCC - SMD/SMT SOFT 3025 25V 47uF X7R 20% AEC-Q200 Source: Datasheet <https://componentsearchengine.com/Datasheets/1/CGADN3X7R1E476M230LE.pdf>; DESCRIPTION: Multilayer Ceramic Capacitors MLCC - SMD/SMT SOFT 3025 25V 47uF X7R 20% AEC-Q200; HEIGHT: 2.5mm; MANUFACTURER_NAME: TDK; MANUFACTURER_PART_NUMBER: CGADN3X7R1E476M230LE; MOUSER_PART_NUMBER: 810-CGADN3X7R1E476ME; MOUSER_PRICE-STOCK: https://www.mouser.com/Search/Refine.aspx?Keyword=810-CGADN3X7R1E476ME
C_F_ C_F_1 C_F_2 = LT3579_SEPIC_Test_Bench:CGA2B2C0G1H470J050BA: MLCC CGA 0402 C0G 47pF 50V Automotive TDK 0402 CGA2 47pF Ceramic Multilayer Capacitor, 50 V dc, +125C, C0G Dielectric, +/-5% Source: Datasheet <https://product.tdk.com/system/files/dam/doc/product/capacitor/ceramic/mlcc/catalog/mlcc_automotive_general_en.pdf>; DESCRIPTION: MLCC CGA 0402 C0G 47pF 50V Automotive TDK 0402 CGA2 47pF Ceramic Multilayer Capacitor, 50 V dc, +125C, C0G Dielectric, +/-5%; HEIGHT: 0.55mm; MANUFACTURER_NAME: TDK; MANUFACTURER_PART_NUMBER: CGA2B2C0G1H470J050BA; MOUSER_PART_NUMBER: 810-CGA2B2C0G1H470J; MOUSER_PRICE-STOCK: https://www.mouser.co.uk/ProductDetail/TDK/CGA2B2C0G1H470J050BA?qs=LcTL%2F5vFEzEvUQdRA7EAJA%3D%3D
C_LDO_IN_ = LT3579_SEPIC_Test_Bench:CGA3E1X7R1V105K080AC: Multilayer Ceramic Capacitors MLCC - SMD/SMT 0603 1uF 35volts X7R 10% T=0.8mm Source: Datasheet <https://product.tdk.com/system/files/dam/doc/product/capacitor/ceramic/mlcc/catalog/mlcc_automotive_general_en.pdf>; DESCRIPTION: Multilayer Ceramic Capacitors MLCC - SMD/SMT 0603 1uF 35volts X7R 10% T=0.8mm; HEIGHT: 0.9mm; MANUFACTURER_NAME: TDK; MANUFACTURER_PART_NUMBER: CGA3E1X7R1V105K080AC; MOUSER_PART_NUMBER: 810-CGA3E1X7R1V105KC; MOUSER_PRICE-STOCK: https://www.mouser.co.uk/ProductDetail/TDK/CGA3E1X7R1V105K080AC?qs=xLDY6iXSiQbKOisZZVHFrA%3D%3D
C_LDO_OUT_ = LT3579_SEPIC_Test_Bench:JMK107BB7475KA-T: Taiyo Yuden JMK107BB7475KA-T 4.7F MLCC 6.3V dc +/-10% Tolerance SMD Source: Datasheet <https://componentsearchengine.com/Datasheets/1/JMK107BB7475KA-T.pdf>; DESCRIPTION: Taiyo Yuden JMK107BB7475KA-T 4.7F MLCC 6.3V dc +/-10% Tolerance SMD; HEIGHT: 0.9mm; MANUFACTURER_NAME: TAIYO YUDEN; MANUFACTURER_PART_NUMBER: JMK107BB7475KA-T; MOUSER_PART_NUMBER: 963-JMK107BB7475KA-T; MOUSER_PRICE-STOCK: https://www.mouser.co.uk/ProductDetail/Taiyo-Yuden/JMK107BB7475KA-T/?qs=Va%252BXcMGJzEswq6AuVGoq3Q%3D%3D
C_LS_ C_LS_1 C_LS_2 = LT3579_SEPIC_Test_Bench:CGA2B2C0G1H102J050BE: Multilayer Ceramic Capacitors MLCC - SMD/SMT 0402 50VDC 1nF 5% C0G AEC-Q200 Source: Datasheet <https://product.tdk.com/system/files/dam/doc/product/capacitor/ceramic/mlcc/catalog/mlcc_automotive_soft_en.pdf>; DESCRIPTION: Multilayer Ceramic Capacitors MLCC - SMD/SMT 0402 50VDC 1nF 5% C0G AEC-Q200; HEIGHT: 0.55mm; MANUFACTURER_NAME: TDK; MANUFACTURER_PART_NUMBER: CGA2B2C0G1H102J050BE; MOUSER_PART_NUMBER: 810-CGA2B2C0G1H102J5; MOUSER_PRICE-STOCK: https://www.mouser.co.uk/ProductDetail/TDK/CGA2B2C0G1H102J050BE?qs=P1JMDcb91o7BA6xd7%2FtTJw%3D%3D
C_SS_ C_SS_1 C_SS_2 = LT3579_SEPIC_Test_Bench:CGA4J2X8R1E224K125AE: Multilayer Ceramic Capacitors MLCC - SMD/SMT SOFT 0805 25V 0.22uF X8R 10% T: 1.25mm Source: Datasheet <https://componentsearchengine.com/Datasheets/1/CGA4J2X8R1E224K125AE.pdf>; DESCRIPTION: Multilayer Ceramic Capacitors MLCC - SMD/SMT SOFT 0805 25V 0.22uF X8R 10% T: 1.25mm; HEIGHT: 1.45mm; MANUFACTURER_NAME: TDK; MANUFACTURER_PART_NUMBER: CGA4J2X8R1E224K125AE; MOUSER_PART_NUMBER: 810-CGA4J2X8R1E224KA; MOUSER_PRICE-STOCK: https://www.mouser.com/Search/Refine.aspx?Keyword=810-CGA4J2X8R1E224KA
D1_ D1_1 D1_2 = LT3579_SEPIC_Test_Bench:MBRS330T3G: Source: Datasheet <http://www.onsemi.com/pub/Collateral/MBRS340T3-D.PDF>; HEIGHT: 2.56mm; MANUFACTURER_NAME: ON Semiconductor; MANUFACTURER_PART_NUMBER: MBRS330T3G; MOUSER_PART_NUMBER: 863-MBRS330T3G; MOUSER_PRICE-STOCK: https://www.mouser.co.uk/ProductDetail/onsemi/MBRS330T3G?qs=3JMERSakebqQvNYO1akzWA%3D%3D
L1L2_ L1L2_1 L1L2_2 = LT3579_SEPIC_Test_Bench:MSD1278T-XXXXX__: The MSD1278T series of shielded coupled inductors was designed specifically for high temperature applications – up to 125°C ambient.
LDO_ = LT3579_SEPIC_Test_Bench:LDL1117S33R: STMICROELECTRONICS - LDL1117S33R - LDO, FIXED, 3.3V, 1.2A, SOT-223-3 Source: Datasheet <https://componentsearchengine.com/Datasheets/2/LDL1117S33R.pdf>; DESCRIPTION: STMICROELECTRONICS - LDL1117S33R - LDO, FIXED, 3.3V, 1.2A, SOT-223-3; HEIGHT: 1.8mm; MANUFACTURER_NAME: STMicroelectronics; MANUFACTURER_PART_NUMBER: LDL1117S33R; MOUSER_PART_NUMBER: 511-LDL1117S33R; MOUSER_PRICE-STOCK: https://www.mouser.co.uk/ProductDetail/STMicroelectronics/LDL1117S33R?qs=AQlKX63v8Rt9Bf6AWSrbFg%3D%3D
LED_ LED_1 LED_2 = LT3579_SEPIC_Test_Bench:APTD1608LCGCK: Standard LEDs - SMD 0603 Dome Lens LED Green- 570nm Source: Datasheet; DESCRIPTION: Standard LEDs - SMD 0603 Dome Lens LED Green- 570nm; HEIGHT: mm; MANUFACTURER_NAME: Kingbright; MANUFACTURER_PART_NUMBER: APTD1608LCGCK; MOUSER_PART_NUMBER: 604-APTD1608LCGCK; MOUSER_PRICE-STOCK: https://www.mouser.co.uk/ProductDetail/Kingbright/APTD1608LCGCK?qs=AQlKX63v8Rv%252Bp7eo1xBjCA%3D%3D
LT3579_IC_ LT3579_IC_1 LT3579_IC_2 = LT3579_SEPIC_Test_Bench:LT3579EFE#PBF: Linear Technology LT3579EFE#PBF, Boost, Inverting DC-DC Converter, 6A, Adjustable, 20-Pin TSSOP Source: Datasheet <http://www.analog.com/media/en/technical-documentation/data-sheets/35791fa.pdf>; ARROW_PART_NUMBER: LT3579EFE#PBF; ARROW_PRICE-STOCK: https://www.arrow.com/en/products/lt3579efepbf/linear-technology; DESCRIPTION: Linear Technology LT3579EFE#PBF, Boost, Inverting DC-DC Converter, 6A, Adjustable, 20-Pin TSSOP; HEIGHT: 1.2mm; MANUFACTURER_NAME: Linear Technology; MANUFACTURER_PART_NUMBER: LT3579EFE#PBF; MOUSER_PART_NUMBER: 584-LT3579EFE#PBF; MOUSER_PRICE-STOCK: https://www.mouser.com/Search/Refine.aspx?Keyword=584-LT3579EFE%23PBF
NMOS_LDO_ NMOS_LDO_1 NMOS_LDO_2 = LT3579_SEPIC_Test_Bench:RSR025N03HZGTL: MOSFET 30V N-CHANNEL 2.5A Source: Datasheet <https://componentsearchengine.com/Datasheets/2/RSR025N03HZGTL.pdf>; DESCRIPTION: MOSFET 30V N-CHANNEL 2.5A; HEIGHT: 1mm; MANUFACTURER_NAME: ROHM Semiconductor; MANUFACTURER_PART_NUMBER: RSR025N03HZGTL; MOUSER_PART_NUMBER: 755-RSR025N03HZGTL; MOUSER_PRICE-STOCK: https://www.mouser.co.uk/ProductDetail/ROHM-Semiconductor/RSR025N03HZGTL?qs=qSfuJ%252Bfl%2Fd6oUAHuBzgCAw%3D%3D
PMOS_ PMOS_1 PMOS_2 = LT3579_SEPIC_Test_Bench:RQ5E050ATTCL: RQ5E050ATTCL P-Channel MOSFET, 5 A, 30 V RQ5E050AT, 3-Pin SOT-346T ROHM Source: Datasheet <https://datasheet.datasheetarchive.com/originals/distributors/Datasheets_SAMA/17a523b90e759099a35e7e9bd64b44fe.pdf>; DESCRIPTION: RQ5E050ATTCL P-Channel MOSFET, 5 A, 30 V RQ5E050AT, 3-Pin SOT-346T ROHM; HEIGHT: 1mm; MANUFACTURER_NAME: ROHM Semiconductor; MANUFACTURER_PART_NUMBER: RQ5E050ATTCL; MOUSER_PART_NUMBER: 755-RQ5E050ATTCL; MOUSER_PRICE-STOCK: https://www.mouser.co.uk/ProductDetail/ROHM-Semiconductor/RQ5E050ATTCL?qs=r5DSvlrkXmLg5DhvZDYwIQ%3D%3D
PMOS_REVERSE_V_PROTECTION = LT3579_SEPIC_Test_Bench:DMP3015LSSQ-13: MOSFET Single -30V P-Ch Enh FET -20Vgss; AVAILABILITY: In Stock; DESCRIPTION: 30V P-CHANNEL ENHANCEMENT MODE MOSFET; MF: Diodes Inc.; MP: DMP3015LSSQ-13; PACKAGE: SO-8 Diodes Inc.; PRICE: None; PURCHASE-URL: https://www.mouser.com/ProductDetail/Diodes-Incorporated/DMP3015LSSQ-13?qs=NnBbvHfz1MmNJej%2FFBJXWg%3D%3D
R_5.6K_LED2_ = LT3579_SEPIC_Test_Bench:ERA-2ARB562X: Metal Thin Film Chip Resistor, 0402, 0.063W Source: Datasheet <https://componentsearchengine.com/Datasheets/1/ERA-2ARB562X.pdf>; DESCRIPTION: Metal Thin Film Chip Resistor, 0402, 0.063W; HEIGHT: 0.4mm; MANUFACTURER_NAME: Panasonic; MANUFACTURER_PART_NUMBER: ERA-2ARB562X; MOUSER_PART_NUMBER: 667-ERA-2ARB562X; MOUSER_PRICE-STOCK: https://www.mouser.com/Search/Refine.aspx?Keyword=667-ERA-2ARB562X
R_5K_F_ R_5K_F_1 R_5K_F_2 R_UVLO2_ R_UVLO2_1 R_UVLO2_2 = LT3579_SEPIC_Test_Bench:RT1206BRD075KL: THIN FILM CHIP RESISTORS High precision- high stability RT series Source: Datasheet <https://datasheet.datasheetarchive.com/originals/distributors/Datasheets_SAMA/a1f8f48f216d234b3e6a96d43a77a0c1.pdf>; DESCRIPTION: THIN FILM CHIP RESISTORS High precision- high stability RT series; HEIGHT: 0.65mm; MANUFACTURER_NAME: YAGEO (PHYCOMP); MANUFACTURER_PART_NUMBER: RT1206BRD075KL; MOUSER_PART_NUMBER: 603-RT1206BRD075KL; MOUSER_PRICE-STOCK: https://www.mouser.co.uk/ProductDetail/Yageo/RT1206BRD075KL?qs=8cPjvKtxWv5bP%252BIM%2FRQCeQ%3D%3D
R_10K_F_ R_10K_F_1 R_10K_F_2 = LT3579_SEPIC_Test_Bench:AC0805DR-0710KL: RES SMD 18 OHM 5% 1/8W 0805 Check availability <https://pricing.snapeda.com/parts/AC0805DR-0710KL/YAGEO/view-part?ref=eda>; AVAILABILITY: In Stock; DESCRIPTION: Thick Film Resistors - SMD 10kOhms 1/8W 0805 0.5% AEC-Q200; MF: YAGEO; MP: AC0805DR-0710KL; PACKAGE: None; PRICE: None
R_20K_LED1_ = LT3579_SEPIC_Test_Bench:ERJ-2RKF2002X: Precision Thick Film Chip Resistor, 0402, 0.063W Source: Datasheet <http://industrial.panasonic.com/cdbs/www-data/pdf/RDA0000/AOA0000C304.pdf>; DESCRIPTION: Precision Thick Film Chip Resistor, 0402, 0.063W; HEIGHT: 0.4mm; MANUFACTURER_NAME: Panasonic; MANUFACTURER_PART_NUMBER: ERJ-2RKF2002X; MOUSER_PART_NUMBER: 667-ERJ-2RKF2002X; MOUSER_PRICE-STOCK: https://www.mouser.co.uk/ProductDetail/Panasonic/ERJ-2RKF2002X?qs=H7k1u0Mp9JTOxRcN%252B6dzQw%3D%3D
R_C_ R_C_1 R_C_2 = LT3579_SEPIC_Test_Bench:AC0805JR-0712KL: Thick Film Resistors - SMD 1/8W 12K ohm 5% AEC-Q200 Source: Datasheet <https://www.yageo.com/upload/media/product/productsearch/datasheet/rchip/PYu-AC_51_RoHS_L_8.pdf>; DESCRIPTION: Thick Film Resistors - SMD 1/8W 12K ohm 5% AEC-Q200; HEIGHT: 0.6mm; MANUFACTURER_NAME: YAGEO (PHYCOMP); MANUFACTURER_PART_NUMBER: AC0805JR-0712KL; MOUSER_PART_NUMBER: 603-AC0805JR-0712KL; MOUSER_PRICE-STOCK: https://www.mouser.co.uk/ProductDetail/Yageo/AC0805JR-0712KL?qs=ygRr%2FtkhteuiNEuAWdf3HA%3D%3D
R_FAULT_ R_FAULT_1 R_FAULT_2 R_LS_GATE_ R_LS_GATE_1 R_LS_GATE_2 = LT3579_SEPIC_Test_Bench:AT0805FRE07100KL: Thin Film Resistors - SMD 0805 100kOhms 1.0% 50PPM 125mW AEC-Q200 Check availability <https://www.mouser.com/ProductDetail/YAGEO/AT0805FRE07100KL?qs=sGAEpiMZZMtlubZbdhIBIMaxnMKvEBNdDSHHfFClmJg%3D>; AVAILABILITY: In Stock; DESCRIPTION: Thin Film Resistors - SMD 0805 100kOhms 1.0% 50PPM 125mW AEC-Q200; MF: Yageo; MP: AT0805FRE07150KL; PACKAGE: 2012 Rohm Semiconductor; PRICE: None; PURCHASE-URL: https://www.mouser.com/ProductDetail/YAGEO/AT0805FRE07100KL?qs=sGAEpiMZZMtlubZbdhIBIMaxnMKvEBNdDSHHfFClmJg%3D
R_FB_ = LT3579_SEPIC_Test_Bench:AC0805FR-07150KL: RES SMD 150K OHM 1% 1/8W 0805 Check availability <https://pricing.snapeda.com/parts/AC0805FR-07150KL/Yageo/view-part?ref=eda>; AVAILABILITY: In Stock; DESCRIPTION: 150 kOhms ±1% 0.125W, 1/8W Chip Resistor 0805 (2012 Metric) Automotive AEC-Q200, Moisture Resistant Thick Film; MF: Yageo; MP: AC0805FR-07150KL; PACKAGE: 2012 Rohm Semiconductor; PRICE: None; PURCHASE-URL: https://pricing.snapeda.com/search/part/AC0805FR-07150KL/?ref=eda
R_FB_1 = LT3579_SEPIC_Test_Bench:AC0603FR-0764K9L: RES SMD 64.9K OHM 1% 1/10W 0603 Check availability <https://pricing.snapeda.com/parts/AC0603FR-0764K9L/Yageo/view-part?ref=eda>; AVAILABILITY: In Stock; DESCRIPTION: Res Smd 64.9k Ohm 1% 1/10w 0603; MF: Yageo; MP: AC0603FR-0764K9L; PACKAGE: 1608 Yageo; PRICE: None; PURCHASE-URL: https://pricing.snapeda.com/search/part/AC0603FR-0764K9L/?ref=eda
R_FB_2 = LT3579_SEPIC_Test_Bench:AC0805FR-0745K3L: RES SMD 45.3K OHM 1% 1/8W 0805 Check availability <https://www.mouser.com/ProductDetail/YAGEO/AC0805FR-0745K3L?qs=UBLIud9aIG27CXHbsp3wlg%3D%3D>; AVAILABILITY: In Stock; DESCRIPTION: Thick Film Resistors - SMD 45.3kOhms 1/8W 0805 1% AEC-Q200; MF: Yageo; MP: AC0805FR-0730KL; PACKAGE: 2012 Rohm Semiconductor; PRICE: None; PURCHASE-URL: https://www.mouser.com/ProductDetail/YAGEO/AC0805FR-0745K3L?qs=UBLIud9aIG27CXHbsp3wlg%3D%3D
R_GATE_ R_GATE_1 R_GATE_2 = LT3579_SEPIC_Test_Bench:AC0805FR-0710KL: Thick Film Resistors - SMD 10K ohm 1% 1/8W AEC-Q200 Source: Datasheet <https://datasheet.datasheetarchive.com/originals/distributors/Datasheets_SAMA/9c9982b5f9d8b10ce9b597e40b391084.pdf>; DESCRIPTION: Thick Film Resistors - SMD 10K ohm 1% 1/8W AEC-Q200; HEIGHT: 0.6mm; MANUFACTURER_NAME: YAGEO (PHYCOMP); MANUFACTURER_PART_NUMBER: AC0805FR-0710KL; MOUSER_PART_NUMBER: 603-AC0805FR-0710KL; MOUSER_PRICE-STOCK: https://www.mouser.co.uk/ProductDetail/YAGEO/AC0805FR-0710KL?qs=yhV1fb9g%2FKbswcDAMQpnRQ%3D%3D
R_LED_10K_1 R_LED_10K_2 R_LS_DRAIN_ R_LS_DRAIN_1 R_LS_DRAIN_2 = LT3579_SEPIC_Test_Bench:MCS0402MD1002DE000: Thin Film Resistors - SMD .1W 10Kohms .5% 0402 25ppm Auto Source: Datasheet <https://componentsearchengine.com/Datasheets/1/MCS0402MD1002DE000.pdf>; DESCRIPTION: Thin Film Resistors - SMD .1W 10Kohms .5% 0402 25ppm Auto; HEIGHT: 0.37mm; MANUFACTURER_NAME: Vishay; MANUFACTURER_PART_NUMBER: MCS0402MD1002DE000; MOUSER_PART_NUMBER: 594-MCS0402MD1002DE0; MOUSER_PRICE-STOCK: http://www.mouser.com/Search/ProductDetail.aspx?qs=EzBFWPtgsb0jQNGsPHo%2fIQ%3d%3d
R_SHUNT_GND_ R_SHUNT_GND_1 R_SHUNT_GND_2 = LT3579_SEPIC_Test_Bench:GMR100HTCFAR100: Res 2512 0.1 Ohm 1% 3W ±20ppm/C Pad SMD Automotive T/R Check availability <https://pricing.snapeda.com/parts/GMR100HTCFAR100/Rohm/view-part?ref=eda>; AVAILABILITY: In Stock; DESCRIPTION: 100 mOhms ±1% 7W Chip Resistor 2512 (6432 Metric) Automotive AEC-Q200 Metal Element; MF: Rohm; MP: GMR100HTCFAR100; PACKAGE: 6432 Rohm Semiconductor; PRICE: None; PURCHASE-URL: https://pricing.snapeda.com/search/part/GMR100HTCFAR100/?ref=eda
R_T_ R_T_1 R_T_2 = LT3579_SEPIC_Test_Bench:AC0805FR-07124KL: Thick Film Resistors - SMD AEC-Q200 Source: Datasheet <https://componentsearchengine.com/Datasheets/1/AC0805FR-07124KL.pdf>; DESCRIPTION: Thick Film Resistors - SMD AEC-Q200; HEIGHT: 0.6mm; MANUFACTURER_NAME: YAGEO (PHYCOMP); MANUFACTURER_PART_NUMBER: AC0805FR-07124KL; MOUSER_PART_NUMBER: 603-AC0805FR-07124KL; MOUSER_PRICE-STOCK: https://www.mouser.com/Search/Refine.aspx?Keyword=603-AC0805FR-07124KL
R_UVLO1_ R_UVLO1_1 R_UVLO1_2 = LT3579_SEPIC_Test_Bench:AC0805FR-0730KL: RES SMD 30K OHM 1% 1/8W 0805 Check availability <https://pricing.snapeda.com/parts/AC0805FR-0730KL/Yageo/view-part?ref=eda>; AVAILABILITY: In Stock; DESCRIPTION: 30 kOhms ±1% 0.125W, 1/8W Chip Resistor 0805 (2012 Metric) Automotive AEC-Q200, Moisture Resistant Thick Film; MF: Yageo; MP: AC0805FR-0730KL; PACKAGE: 2012 Rohm Semiconductor; PRICE: None; PURCHASE-URL: https://pricing.snapeda.com/search/part/AC0805FR-0730KL/?ref=eda
TP_CF_ TP_CF_1 TP_CF_2 TP_CH_GND_ TP_CH_GND_1 TP_CH_GND_2 TP_CLK_ TP_CLK_1 TP_CLK_2 TP_CLK_F_ TP_CLK_F_1 TP_CLK_F_2 TP_D1_ TP_D1_1 TP_D1_2 TP_FAULT_ TP_FAULT_1 TP_FAULT_2 TP_FAULT_LS_ TP_FAULT_LS_1 TP_FAULT_LS_2 TP_FB_ TP_FB_1 TP_FB_2 TP_GATE_ TP_GATE_1 TP_GATE_2 TP_GND1_ TP_GND1_1 TP_GND1_2 TP_GND2_ TP_GND2_1 TP_GND2_2 TP_GND3_ TP_GND3_1 TP_GND3_2 TP_GND4_ TP_GND4_1 TP_GND4_2 TP_GND_ TP_GND_1 TP_GND_2 TP_IN_ TP_IN_1 TP_IN_2 TP_LDO_OUT_ TP_OUT_ TP_OUT_1 TP_OUT_2 TP_RT_ TP_RT_1 TP_RT_2 TP_SHDN_ TP_SHDN_1 TP_SHDN_2 TP_SS_ TP_SS_1 TP_SS_2 TP_SW_ TP_SW_1 TP_SW_2 = LT3579_SEPIC_Test_Bench:S1751-46R: Circuit Board Hardware - PCB SMT TEST TERMINAL TIN, 2500 PC REEL; DESC: Circuit Board Hardware - PCB SMT TEST TERMINAL TIN, 2500 PC REEL; MFR: Harwin; TYPE: TEST POINT; URL: https://www.mouser.com/ProductDetail/Harwin/S1751-46R?qs=l6ZPVqNVZb71wETAKrfRig%3D%3D
U$1-U$4 = LT3579_SEPIC_Test_Bench:THROUGH_HOLE_

## Net classes
1 PWR_Connector: width 3.29 mm
2 PWR_Vin_Vout: width 0.816 mm
3 Signal: width 0.381 mm
4 PWR_Vin: width 0.046 mm